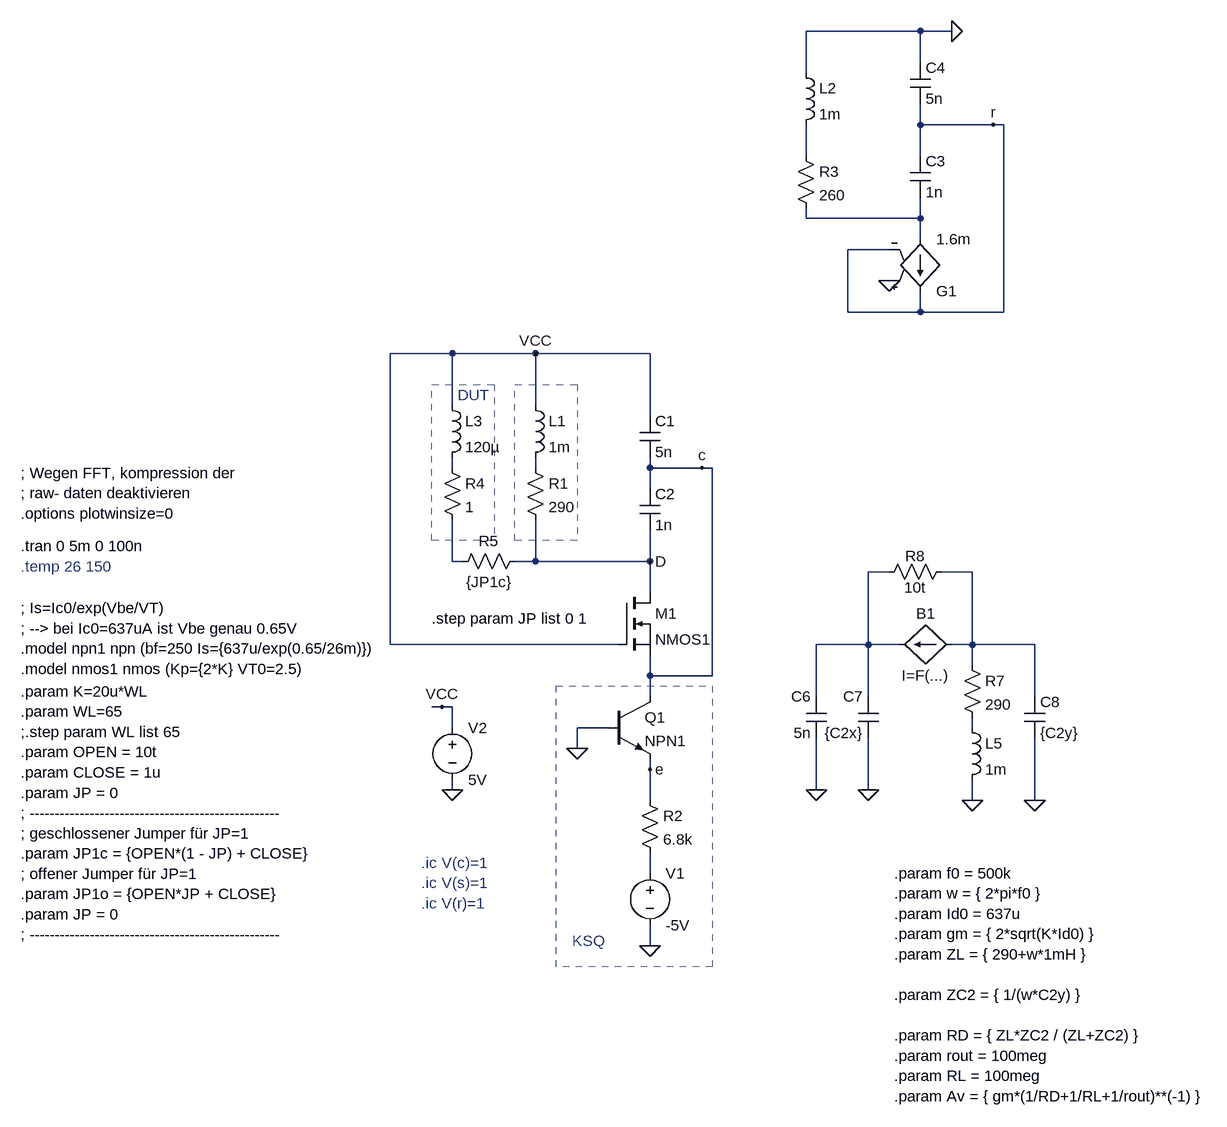
[diagram p0: schematic ss2013_collpits_osc_06-12-2014.asc]
ss2013_collpits_osc_06-12-2014.asc, the LTspice schematic file:
Version 4
SHEET 1 880 856
WIRE -96 -1552 -272 -1552
WIRE -48 -1552 -96 -1552
WIRE -96 -1504 -96 -1552
WIRE -272 -1488 -272 -1552
WIRE -96 -1408 -96 -1440
WIRE 16 -1408 -96 -1408
WIRE 32 -1408 16 -1408
WIRE -272 -1360 -272 -1408
WIRE -96 -1360 -96 -1408
WIRE -272 -1264 -272 -1280
WIRE -96 -1264 -96 -1296
WIRE -96 -1264 -272 -1264
WIRE -96 -1232 -96 -1264
WIRE -144 -1216 -208 -1216
WIRE -208 -1120 -208 -1216
WIRE -96 -1120 -96 -1152
WIRE -96 -1120 -208 -1120
WIRE 32 -1120 32 -1408
WIRE 32 -1120 -96 -1120
WIRE -816 -1056 -912 -1056
WIRE -688 -1056 -816 -1056
WIRE -512 -1056 -688 -1056
WIRE -816 -976 -816 -1056
WIRE -688 -976 -688 -1056
WIRE -512 -960 -512 -1056
WIRE -816 -880 -816 -896
WIRE -688 -880 -688 -896
WIRE -512 -880 -512 -896
WIRE -432 -880 -512 -880
WIRE -416 -880 -432 -880
WIRE -512 -848 -512 -880
WIRE -816 -736 -816 -800
WIRE -800 -736 -816 -736
WIRE -688 -736 -688 -800
WIRE -688 -736 -720 -736
WIRE -512 -736 -512 -784
WIRE -512 -736 -688 -736
WIRE -144 -720 -176 -720
WIRE -16 -720 -64 -720
WIRE -512 -688 -512 -736
WIRE -912 -608 -912 -1056
WIRE -560 -608 -912 -608
WIRE -176 -608 -176 -720
WIRE -176 -608 -256 -608
WIRE -128 -608 -176 -608
WIRE -16 -608 -16 -720
WIRE -16 -608 -48 -608
WIRE 80 -608 -16 -608
WIRE -16 -576 -16 -608
WIRE -512 -560 -512 -592
WIRE -416 -560 -416 -880
WIRE -416 -560 -512 -560
WIRE -512 -528 -512 -560
WIRE -256 -528 -256 -608
WIRE -176 -528 -176 -608
WIRE 80 -528 80 -608
WIRE -832 -512 -848 -512
WIRE -816 -512 -832 -512
WIRE -816 -480 -816 -512
WIRE -576 -480 -624 -480
WIRE -16 -480 -16 -496
WIRE -624 -448 -624 -480
WIRE -512 -416 -512 -432
WIRE -816 -384 -816 -400
WIRE -256 -384 -256 -464
WIRE -176 -384 -176 -464
WIRE -512 -368 -512 -416
WIRE -16 -368 -16 -400
WIRE 80 -368 80 -464
WIRE -512 -256 -512 -288
WIRE -512 -144 -512 -176
FLAG -816 -384 0
FLAG -512 -144 0
FLAG -624 -448 0
FLAG -432 -880 c
FLAG -512 -736 D
FLAG -512 -416 e
FLAG -48 -1552 0
FLAG -144 -1168 0
FLAG 16 -1408 r
FLAG -688 -1056 VCC
FLAG -832 -512 VCC
FLAG -16 -368 0
FLAG 80 -368 0
FLAG -176 -384 0
FLAG -256 -384 0
SYMBOL ind -704 -992 R0
SYMATTR InstName L1
SYMATTR Value 1m
SYMBOL res -704 -896 R0
SYMATTR InstName R1
SYMATTR Value 290
SYMBOL cap -528 -960 R0
SYMATTR InstName C1
SYMATTR Value 5n
SYMBOL cap -528 -848 R0
SYMATTR InstName C2
SYMATTR Value 1n
SYMBOL nmos -560 -688 R0
SYMATTR InstName M1
SYMATTR Value NMOS1
SYMBOL npn -576 -528 R0
SYMATTR InstName Q1
SYMATTR Value NPN1
SYMBOL res -528 -384 R0
SYMATTR InstName R2
SYMATTR Value 6.8k
SYMBOL voltage -512 -272 R0
WINDOW 123 0 0 Left 2
WINDOW 39 0 0 Left 2
SYMATTR InstName V1
SYMATTR Value -5V
SYMBOL voltage -816 -496 R0
SYMATTR InstName V2
SYMATTR Value 5V
SYMBOL g -96 -1136 M180
SYMATTR InstName G1
SYMATTR Value 1.6m
SYMBOL cap -112 -1360 R0
SYMATTR InstName C3
SYMATTR Value 1n
SYMBOL cap -112 -1504 R0
SYMATTR InstName C4
SYMATTR Value 5n
SYMBOL res -288 -1376 R0
SYMATTR InstName R3
SYMATTR Value 260
SYMBOL ind -288 -1504 R0
SYMATTR InstName L2
SYMATTR Value 1m
SYMBOL ind -832 -992 R0
SYMATTR InstName L3
SYMATTR Value 120µ
SYMBOL res -832 -896 R0
SYMATTR InstName R4
SYMATTR Value 1
SYMBOL res -704 -752 R90
WINDOW 0 0 56 VBottom 2
WINDOW 3 32 56 VTop 2
SYMATTR InstName R5
SYMATTR Value {JP1c}
SYMBOL cap -240 -464 R180
WINDOW 0 24 64 Left 2
WINDOW 3 24 8 Left 2
SYMATTR InstName C6
SYMATTR Value 5n
SYMBOL cap -160 -464 R180
WINDOW 0 24 64 Left 2
WINDOW 3 24 8 Left 2
SYMATTR InstName C7
SYMATTR Value {C2x}
SYMBOL bi -48 -608 R90
WINDOW 0 -32 40 VBottom 2
WINDOW 3 32 40 VTop 2
SYMATTR InstName B1
SYMBOL res -32 -592 R0
SYMATTR InstName R7
SYMATTR Value 290
SYMBOL ind -32 -496 R0
SYMATTR InstName L5
SYMATTR Value 1m
SYMBOL res -160 -704 R270
WINDOW 0 25 56 VTop 2
WINDOW 3 7 56 VBottom 2
SYMATTR InstName R8
SYMATTR Value 10t
SYMBOL cap 64 -528 R0
SYMATTR InstName C8
SYMATTR Value {C2y}
TEXT -1480 -664 Left 2 !; Is=Ic0/exp(Vbe/VT) \n; --> bei Ic0=637uA ist Vbe genau 0.65V\n.model npn1 npn (bf=250 Is={637u/exp(0.65/26m)})    \n.model nmos1 nmos (Kp={2*K} VT0=2.5)
TEXT -1480 -760 Left 2 !.tran 0 5m 0 100n
TEXT -864 -272 Left 2 ;.ic V(c)=1\n.ic V(s)=1\n.ic V(r)=1
TEXT -1480 -536 Left 2 !.param K=20u*WL\n.param WL=65\n;.step param WL list 65\n.param OPEN = 10t\n.param CLOSE = 1u\n.param JP = 0\n; --------------------------------------------------\n; geschlossener Jumper für JP=1\n.param JP1c = {OPEN*(1 - JP) + CLOSE} \n; offener Jumper für JP=1  \n.param JP1o = {OPEN*JP + CLOSE}\n.param JP = 0\n; --------------------------------------------------
TEXT -1480 -872 Left 2 !; Wegen FFT, kompression der \n; raw- daten deaktivieren\n.options plotwinsize=0
TEXT -1480 -728 Left 2 ;.temp 26 150
TEXT -848 -648 Left 2 !.step param JP list 0 1
TEXT -808 -992 Left 2 ;DUT
TEXT -632 -152 Left 2 ;KSQ
TEXT -136 -256 Left 2 !.param f0 = 500k\n.param w = { 2*pi*f0 }\n.param Id0 = 637u\n.param gm = { 2*sqrt(K*Id0) }\n.param ZL = { 290+w*1mH }\n \n.param ZC2 = { 1/(w*C2y) }\n \n.param RD = { ZL*ZC2 / (ZL+ZC2) }\n.param rout = 100meg\n.param RL = 100meg\n.param Av = { gm*(1/RD+1/RL+1/rout)**(-1) }
RECTANGLE Normal -624 -768 -720 -1008 2
RECTANGLE Normal -752 -768 -848 -1008 2
RECTANGLE Normal -416 -112 -656 -544 2

The netlist it stands for:
* ss2013_collpits_osc_06-12-2014.asc
L1 VCC N004 1m
R1 N004 D 290
C1 VCC c 5n
C2 c D 1n
M1 D VCC c c NMOS1
Q1 c 0 e 0 NPN1
R2 e N009 6.8k
V1 N009 0 -5V
V2 VCC 0 5V
G1 N002 r 0 r 1.6m
C3 r N002 1n
C4 0 r 5n
R3 N001 N002 260
L2 0 N001 1m
L3 VCC N003 120µ
R4 N003 N005 1
R5 D N005 {JP1c}
C6 0 N006 5n
C7 0 N006 {C2x}
B1 N007 N006 I=F(...)
R7 N007 N008 290
L5 N008 0 1m
R8 N006 N007 10t
C8 N007 0 {C2y}
.model NPN NPN
.model PNP PNP
.lib standard.bjt
.model NMOS NMOS
.model PMOS PMOS
.lib standard.mos
; Is=Ic0/exp(Vbe/VT)
; --> bei Ic0=637uA ist Vbe genau 0.65V
.model npn1 npn (bf=250 Is={637u/exp(0.65/26m)})
.model nmos1 nmos (Kp={2*K} VT0=2.5)
.tran 0 5m 0 100n
* .ic V(c)=1
* .ic V(s)=1
* .ic V(r)=1
.param K=20u*WL
.param WL=65
;.step param WL list 65
.param OPEN = 10t
.param CLOSE = 1u
.param JP = 0
; --------------------------------------------------
; geschlossener Jumper für JP=1
.param JP1c = {OPEN*(1 - JP) + CLOSE}
; offener Jumper für JP=1
.param JP1o = {OPEN*JP + CLOSE}
.param JP = 0
; --------------------------------------------------
; Wegen FFT, kompression der
; raw- daten deaktivieren
.options plotwinsize=0
* .temp 26 150
.step param JP list 0 1
* DUT
* KSQ
.param f0 = 500k
.param w = { 2*pi*f0 }
.param Id0 = 637u
.param gm = { 2*sqrt(K*Id0) }
.param ZL = { 290+w*1mH }
.param ZC2 = { 1/(w*C2y) }
.param RD = { ZL*ZC2 / (ZL+ZC2) }
.param rout = 100meg
.param RL = 100meg
.param Av = { gm*(1/RD+1/RL+1/rout)**(-1) }
.backanno
.end